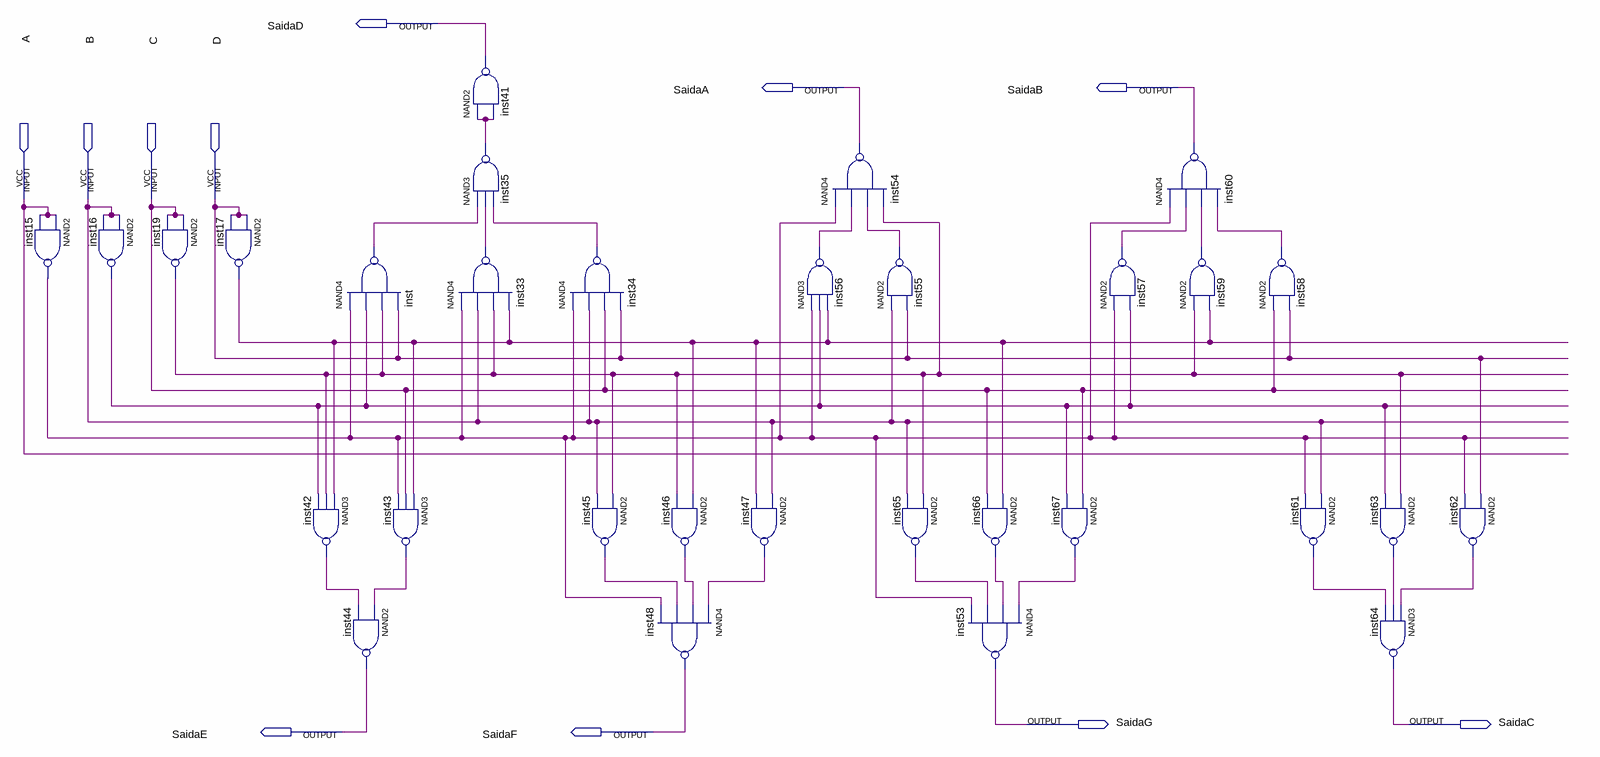
[diagram p0: schematic sheet]
// Quartus schematic DecodificadorBCD.bdf as structural Verilog: 31 symbols, 11 pins
module DecodificadorBCD (
  input  A,
  input  B,
  input  C,
  input  D,
  output SaidaD,
  output SaidaA,
  output SaidaB,
  output SaidaG,
  output SaidaC,
  output SaidaE,
  output SaidaF
);

  wire inst15_out, inst16_out, inst17_out, inst19_out, inst33_out, inst34_out, inst35_out, inst42_out,
       inst43_out, inst45_out, inst46_out, inst47_out, inst55_out, inst56_out, inst57_out, inst58_out,
       inst59_out, inst61_out, inst62_out, inst63_out, inst65_out, inst66_out, inst67_out, inst_out;

  nand inst15 (inst15_out, A, A);
  nand inst16 (inst16_out, B, B);
  nand inst19 (inst19_out, C, C);
  nand inst17 (inst17_out, D, D);
  nand inst (inst_out, inst15_out, inst16_out, inst19_out, D);
  nand inst42 (inst42_out, inst17_out, inst19_out, inst16_out);
  nand inst43 (inst43_out, inst17_out, C, inst15_out);
  nand inst44 (SaidaE, inst43_out, inst42_out);
  nand inst41 (SaidaD, inst35_out, inst35_out);
  nand inst35 (inst35_out, inst_out, inst33_out, inst34_out);
  nand inst33 (inst33_out, inst15_out, B, inst19_out, inst17_out);
  nand inst34 (inst34_out, inst15_out, B, C, D);
  nand inst45 (inst45_out, inst19_out, B);
  nand inst48 (SaidaF, inst47_out, inst46_out, inst45_out, inst15_out);
  nand inst46 (inst46_out, inst17_out, inst19_out);
  nand inst47 (inst47_out, B, inst17_out);
  nand inst54 (SaidaA, inst15_out, inst56_out, inst55_out, inst19_out);
  nand inst56 (inst56_out, inst15_out, inst16_out, inst17_out);
  nand inst55 (inst55_out, B, D);
  nand inst65 (inst65_out, inst19_out, B);
  nand inst66 (inst66_out, inst17_out, C);
  nand inst53 (SaidaG, inst67_out, inst66_out, inst65_out, inst15_out);
  nand inst57 (inst57_out, inst15_out, inst16_out);
  nand inst67 (inst67_out, C, inst16_out);
  nand inst60 (SaidaB, inst15_out, inst57_out, inst59_out, inst58_out);
  nand inst59 (inst59_out, inst19_out, inst17_out);
  nand inst58 (inst58_out, C, D);
  nand inst61 (inst61_out, B, inst15_out);
  nand inst63 (inst63_out, inst19_out, inst16_out);
  nand inst64 (SaidaC, inst62_out, inst63_out, inst61_out);
  nand inst62 (inst62_out, D, inst15_out);
endmodule
